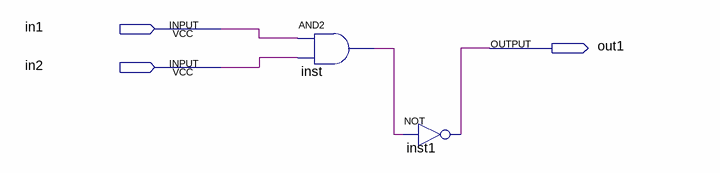
[diagram p0: schematic sheet]
// Quartus schematic out25.bdf as structural Verilog: 2 symbols, 3 pins
module out25 (
  input  in1,
  input  in2,
  output out1
);

  wire inst_out;

  and inst (inst_out, in1, in2);
  not inst1 (out1, inst_out);
endmodule
